# EAGLE design TLC5940_Breakout-v13 (EAGLE 6.4)
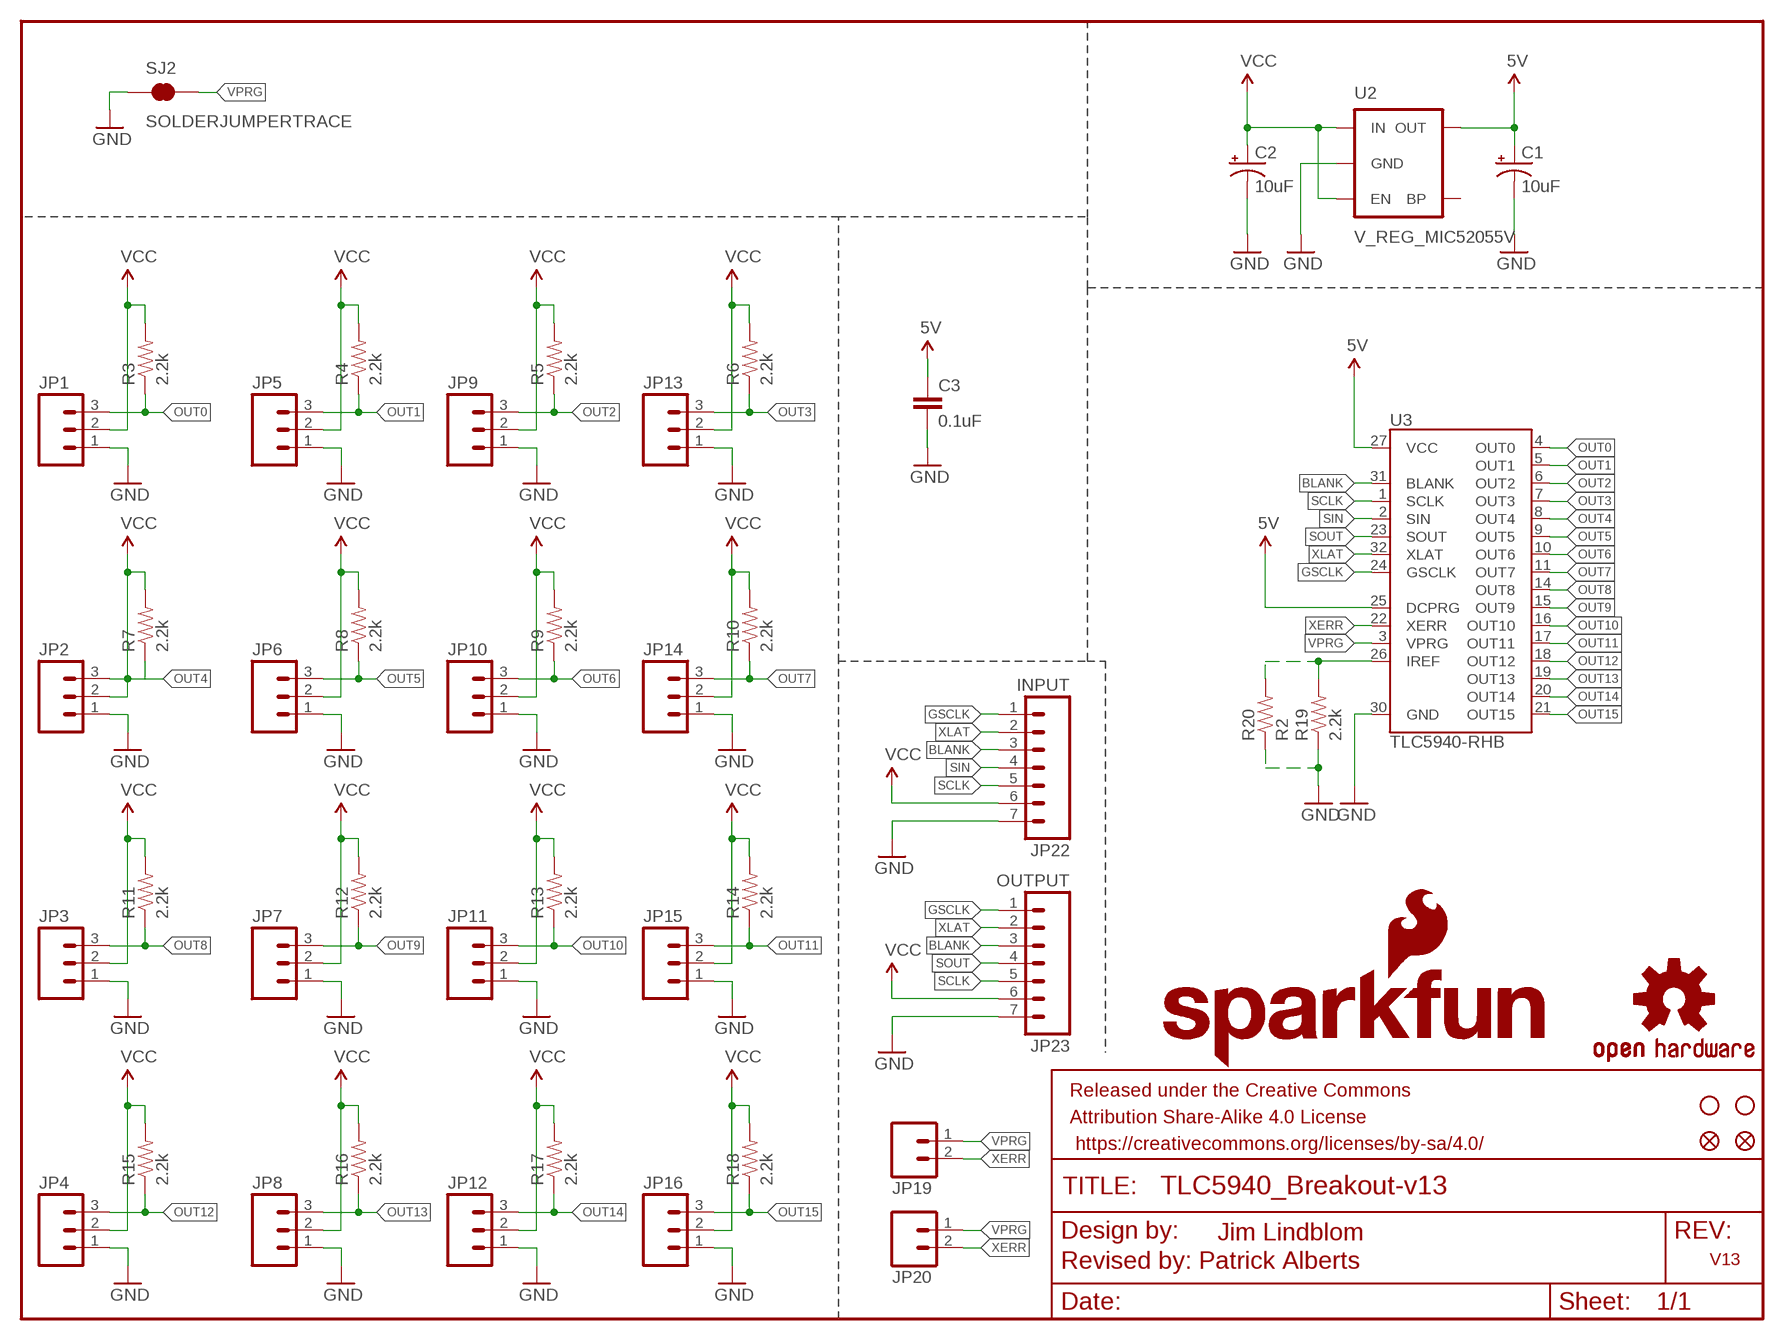
[diagram p0: schematic, sheet 1]

## Parts
C1  10uF  10UF-16V-10%(TANT)  [EIA3216]
C2  10uF  10UF-20V-10%(TANT)  [EIA3528]
C3  0.1uF  0.1UF-25V(+80/-20%)(0603)  [0603-CAP]
FRAME1  FRAME-LETTER  [CREATIVE_COMMONS]
JP1  M03PTH  [1X03]
JP2  M03PTH  [1X03]
JP3  M03PTH  [1X03]
JP4  M03PTH  [1X03]
JP5  M03PTH  [1X03]
JP6  M03PTH  [1X03]
JP7  M03PTH  [1X03]
JP8  M03PTH  [1X03]
JP9  M03PTH  [1X03]
JP10  M03PTH  [1X03]
JP11  M03PTH  [1X03]
JP12  M03PTH  [1X03]
JP13  M03PTH  [1X03]
JP14  M03PTH  [1X03]
JP15  M03PTH  [1X03]
JP16  M03PTH  [1X03]
JP17  STAND-OFF  [STAND-OFF]
JP18  STAND-OFF  [STAND-OFF]
JP19  M02PTH  [1X02]
JP20  M02PTH  [1X02]
JP22  INPUT  M07  [1X07]
JP23  OUTPUT  M07  [1X07]
JP26  FIDUCIAL1X2  [FIDUCIAL-1X2]
JP27  FIDUCIAL1X2.5  [FIDUCIAL-1X2.5]
LOGO1  OSHW-LOGOS  [OSHW-LOGO-S]
LOGO2  SFE_LOGO_NAME_FLAME.2_INCH  [SFE_LOGO_NAME_FLAME_.2]
R3  2.2k  2.2KOHM-1/10W-1%(0603)  [0603-RES]
R4  2.2k  2.2KOHM-1/10W-1%(0603)  [0603-RES]
R5  2.2k  2.2KOHM-1/10W-1%(0603)  [0603-RES]
R6  2.2k  2.2KOHM-1/10W-1%(0603)  [0603-RES]
R7  2.2k  2.2KOHM-1/10W-1%(0603)  [0603-RES]
R8  2.2k  2.2KOHM-1/10W-1%(0603)  [0603-RES]
R9  2.2k  2.2KOHM-1/10W-1%(0603)  [0603-RES]
R10  2.2k  2.2KOHM-1/10W-1%(0603)  [0603-RES]
R11  2.2k  2.2KOHM-1/10W-1%(0603)  [0603-RES]
R12  2.2k  2.2KOHM-1/10W-1%(0603)  [0603-RES]
R13  2.2k  2.2KOHM-1/10W-1%(0603)  [0603-RES]
R14  2.2k  2.2KOHM-1/10W-1%(0603)  [0603-RES]
R15  2.2k  2.2KOHM-1/10W-1%(0603)  [0603-RES]
R16  2.2k  2.2KOHM-1/10W-1%(0603)  [0603-RES]
R17  2.2k  2.2KOHM-1/10W-1%(0603)  [0603-RES]
R18  2.2k  2.2KOHM-1/10W-1%(0603)  [0603-RES]
R19  2.2k  2.2KOHM-1/10W-1%(0603)  [0603-RES]
R20  R2  RESISTORKIT  [AXIAL-0.3-KIT]
SJ2  SOLDERJUMPERTRACE  [SJ_2S-TRACE]
U2  V_REG_MIC52055V  [SOT23-5]
U3  TLC5940-RHB  [QFN-32]

## Nets
5V: C1.A(+) C3.1 U2.5(OUT) U3.25(DCPRG) U3.27(VCC)
BLANK: JP22.3 JP23.3 U3.31(BLANK)
GND: C1.C(-) C2.C(-) C3.2 JP1.1 JP2.1 JP3.1 JP4.1 JP5.1 JP6.1 JP7.1 JP8.1 JP9.1 JP10.1 JP11.1 JP12.1 JP13.1 JP14.1 JP15.1 JP16.1 JP22.7 JP23.7 R19.1 R20.P$1 SJ2.1 U2.2(GND) U3.30(GND)
GSCLK: JP22.1 JP23.1 U3.24(GSCLK)
N$1: R19.2 R20.P$2 U3.26(IREF)
OUT0: JP1.3 R3.1 U3.4(OUT0)
OUT1: JP5.3 R4.1 U3.5(OUT1)
OUT2: JP9.3 R5.1 U3.6(OUT2)
OUT3: JP13.3 R6.1 U3.7(OUT3)
OUT4: JP2.3 R7.1 U3.8(OUT4)
OUT5: JP6.3 R8.1 U3.9(OUT5)
OUT6: JP10.3 R9.1 U3.10(OUT6)
OUT7: JP14.3 R10.1 U3.11(OUT7)
OUT8: JP3.3 R11.1 U3.14(OUT8)
OUT9: JP7.3 R12.1 U3.15(OUT9)
OUT10: JP11.3 R13.1 U3.16(OUT10)
OUT11: JP15.3 R14.1 U3.17(OUT11)
OUT12: JP4.3 R15.1 U3.18(OUT12)
OUT13: JP8.3 R16.1 U3.19(OUT13)
OUT14: JP12.3 R17.1 U3.20(OUT14)
OUT15: JP16.3 R18.1 U3.21(OUT15)
SCLK: JP22.5 JP23.5 U3.1(SCLK)
SIN: JP22.4 U3.2(SIN)
SOUT: JP23.4 U3.23(SOUT)
VCC: C2.A(+) JP1.2 JP2.2 JP3.2 JP4.2 JP5.2 JP6.2 JP7.2 JP8.2 JP9.2 JP10.2 JP11.2 JP12.2 JP13.2 JP14.2 JP15.2 JP16.2 JP22.6 JP23.6 R3.2 R4.2 R5.2 R6.2 R7.2 R8.2 R9.2 R10.2 R11.2 R12.2 R13.2 R14.2 R15.2 R16.2 R17.2 R18.2 U2.1(IN) U2.3(EN)
VPRG: JP19.1 JP20.1 SJ2.2 U3.3(VPRG)
XERR: JP19.2 JP20.2 U3.22(XERR)
XLAT: JP22.2 JP23.2 U3.32(XLAT)
Unconnected: U2.4(BP)

## Notes on the sheet
- Jim Lindblom
- Revised by: Patrick Alberts | V13

## Library data of the parts
C1 = SparkFun-Capacitors:10UF-16V-10%(TANT): CAP-00811 1206/EIA-3216 Tantalum capacitor; PROD_ID: CAP-00811
C2 = SparkFun-Capacitors:10UF-20V-10%(TANT): CAP-08063; PROD_ID: CAP-08063
C3 = SparkFun-Capacitors:0.1UF-25V(+80/-20%)(0603): CAP-00810 Ceramic Standard decoupling cap; PROD_ID: CAP-00810
FRAME1 = SparkFun-Aesthetics:FRAME-LETTER: Schematic Frame Standard 8.5x11 US Letter frame
JP1-JP16 = SparkFun:M03: Header 3 Standard 3-pin 0.1" header. Use with straight break away headers (SKU : PRT-00116), right angle break away headers (PRT-00553), swiss pins (PRT-00743), machine pins (PRT-00117), and female headers (PRT-00115). Molex polarized connector foot print use with SKU : PRT-08232 with associated crimp pins and housings.
JP17 JP18 = SparkFun:STAND-OFF: Stand Off This is the mechanical footprint for a #4 phillips button head screw. Use the keepout ring to avoid running the screw head into surrounding components. SKU : PRT-00447
JP19 JP20 = SparkFun:M02: Header 2 Standard 2-pin 0.1" header. Use with straight break away headers (SKU : PRT-00116), right angle break away headers (PRT-00553), swiss pins (PRT-00743), machine pins (PRT-00117), and female headers (PRT-00115). Molex polarized connector foot print use with SKU : PRT-08233 with associated crimp pins and housings.
JP22 JP23 = SparkFun:M07: Header 7 Standard 7-pin 0.1" header. Use with straight break away headers (SKU : PRT-00116), right angle break away headers (PRT-00553), swiss pins (PRT-00743), machine pins (PRT-00117), and female headers (PRT-00115). NOTES ON THE VARIANTS LOCK and LOCK_LONGPADS... This footprint was designed to help hold the alignment of a through-hole component (i.e. 7-pin header) while soldering it into place. You may notice that each hole has been shifted either up or down by 0.005 of an inch from it's more standard position (which is usually a perfectly straight line). This slight alteration caused the pins (the squares in the middle) to touch the edges of the holes. Because they are alternating, it causes a "brace" to hold the header in place. 0.005 has proven to be the perfect amount of "off-center" position when using our standard breakaway headers. Although looks a little odd when you look at the bare footprint, once you have a header in there, the alteration is very hard to notice. Also, if you push a header all the way into place, it is covered up entirely on the bottom side. This idea of altering the position of holes to aid alignment will be further integrated into the Sparkfun Library for other footprints. It can help hold any component with 3 or more connection pins.
JP26 = SparkFun:FIDUCIAL: Fiducial Alignment Points Various fiducial points for machine vision alignment.
JP27 = abes:FIDUCIAL: Fiducial Alignment Points Various fiducial points for machine vision alignment.
LOGO1 = SparkFun-Aesthetics:OSHW-LOGO: Open Source Hardware Logo This logo indicates the piece of hardware it is found on incorporates a OSHW license and/or adheres to the definition of open source hardware found here: http://freedomdefined.org/OSHW
LOGO2 = SparkFun-Aesthetics:SFE_LOGO_NAME_FLAME: SFE Logo, name and flame This is the SparkFun full logo. The logo on the schematic will always be the same size; the package variant is the height of the flame part of the logo. Default layer for the logo on the board is tSilk.
R3-R19 = SparkFun-Resistors:2.2KOHM-1/10W-1%(0603): RES-08272; PROD_ID: RES-08272
R20 = SparkFun-Resistors:RESISTOR: Resistor Basic schematic elements and footprints for 0603, 1206, and PTH resistors.
SJ2 = SparkFun:SOLDERJUMPER: Solder Jumper Standard SMD solder jumper. Used to automate production. Two varients : Normally Open and Normally Closed are the same, but have different paste layers. NC will have a large amount of paste and should jumper during reflow.
U2 = SparkFun-PowerIC:V_REG_MIC5205: V_REG MIC5219 Standard 3.3V and 5V 150mA LDO voltage regulator in SOT-23 layout. Micrel part MIC5205. BP (by-pass) pin is used to lower output noise with 470pF cap, may be left open.; PROD_ID: VREG-00823; VALUE: 5V
U3 = SparkFun-DigitalIC:TLC5940: 16-channel LED Driver with Dot Correction and Grayscale PWM Control The TLC5940 is a 16-channel, constant-current sink LED driver. Each channel has an individually adjustable 4096-step grayscale PWM brightness control and a 64-step, constant-current sink (dot correction). The dot correction adjusts the brightness variations between LED channels and other LED drivers. The dot correction data is stored in an integrated EEPROM. Both grayscale control and dot correction are accessible via a serial interface. A single external resistor sets the maximum current value of all 16 channels. Packages: 28-pin HTSSOP 32-pin 5x5mm QFN 28-pin DIP; PROD_ID: IC-10398

## Board
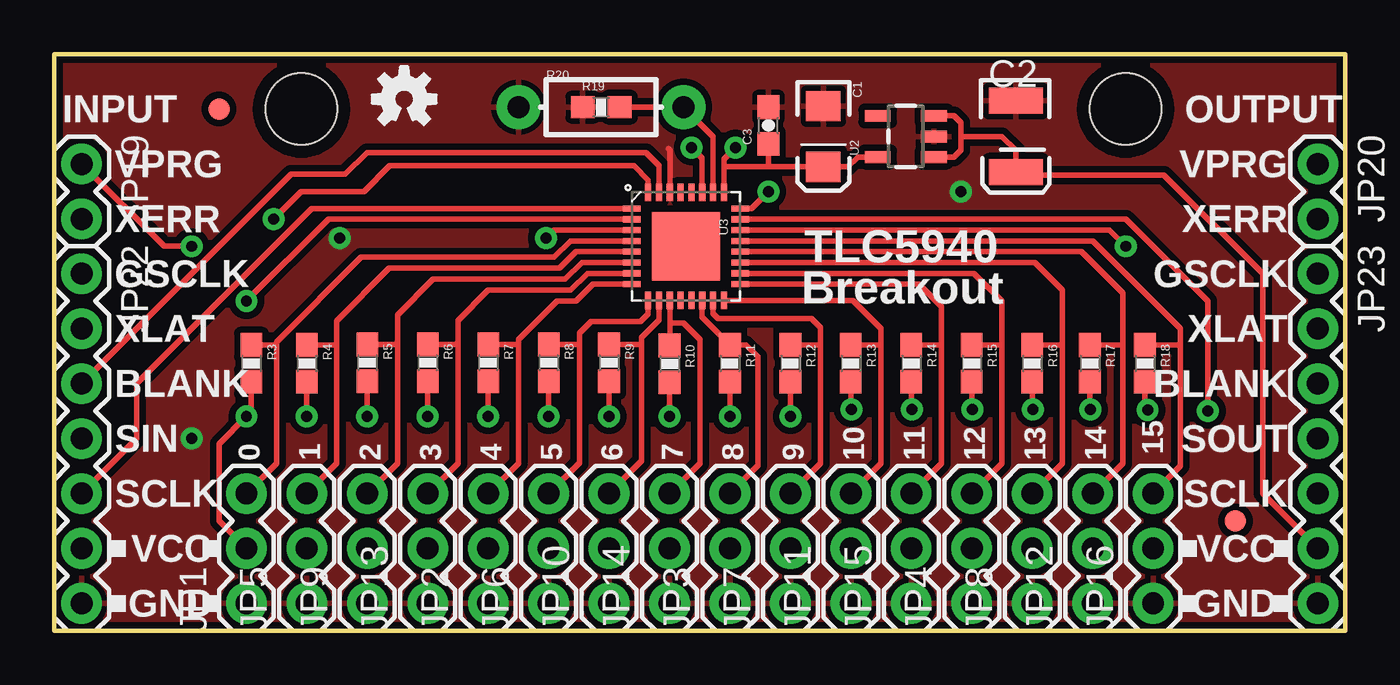
[diagram p1: board, top side]
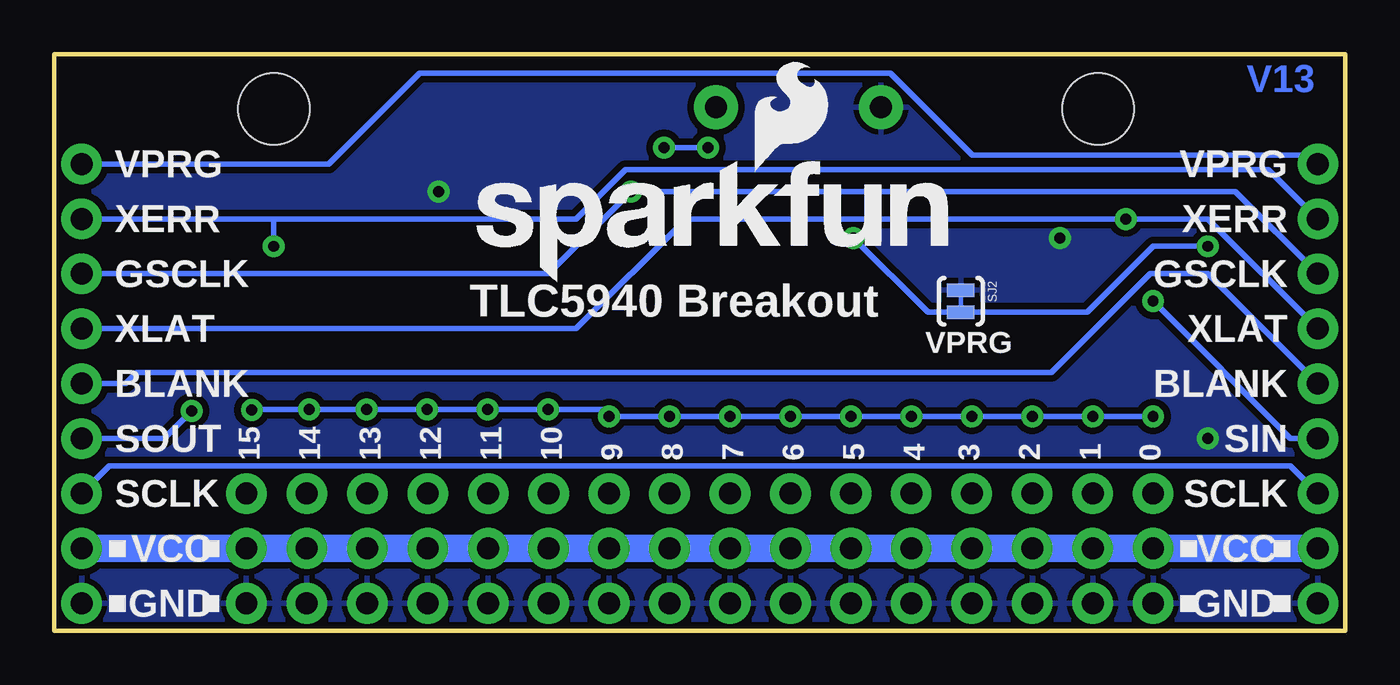
[diagram p2: board, bottom side, seen from below]

Size 59.69 x 26.67 mm. Coordinates in mm from the lower left corner, seen from the top.
Outline: 0,0 0,26.67 59.69,26.67 59.69,0 0,0
Copper layers (1*16): Top 0.035mm / dielectric 1.5mm / Bottom 0.035mm
Design rules "SparkFun *": minimum track width 8mil, minimum drill 20mil, track to track 8mil, track to pad 8mil, pad to pad 8mil, via to via 8mil, smd to smd 8mil, copper to edge 8mil, drill to drill 8mil, minimum pad ring 12mil, minimum via ring 10mil, stop-mask expansion 4mil, vias tented up to drill 20mil, thermal gap 10mil

### Footprints (pad centres in the part's own frame; a part is rotated, then mirrored left to right if it is on the bottom)
EIA3216 = smd 1.4 x 1.6: A 1.4,0; C -1.4,0
EIA3528 = smd 1.2 x 2.5: A 1.65,0; C -1.65,0
0603-CAP = smd 1.1 x 1: 1 -0.85,0; 2 0.85,0
1X03 = drill 1.016 pad 1.88: 1 0,0; 2 2.54,0; 3 5.08,0
STAND-OFF = hole 3.302: 0,0
1X02 = drill 1.016 pad 1.88: 1 0,0; 2 2.54,0
FIDUCIAL-1X2 = smd 1 x 1: 1 0,0
1X07 = drill 1.016 pad 1.88: 1 0,0; 2 2.54,0; 3 5.08,0; 4 7.62,0; 5 10.16,0; 6 12.7,0; 7 15.24,0
0603-RES = smd 1.1 x 1: 1 -0.85,0; 2 0.85,0
AXIAL-0.3-KIT = drill 1.016 pad 2.032: P$1 -3.81,0; P$2 3.81,0
SJ_2S-TRACE = smd 0.635 x 1.27: 1 -0.508,0; 2 0.508,0
SOT23-5 = smd 0.55 x 1.2: 1 -0.95,-1.3; 2 0,-1.3; 3 0.95,-1.3; 4 0.95,1.3; 5 -0.95,1.3
QFN-32 = smd 0.285 x 0.8: 1 -1.75,-2.5; 2 -1.25,-2.5; 3 -0.75,-2.5; 4 -0.25,-2.5; 5 0.25,-2.5; 6 0.75,-2.5; 7 1.25,-2.5; 8 1.75,-2.5; 17 1.75,2.5; 18 1.25,2.5; 19 0.75,2.5; 20 0.25,2.5; 21 -0.25,2.5; 22 -0.75,2.5; 23 -1.25,2.5; 24 -1.75,2.5 | smd 0.8 x 0.285: 9 2.5,-1.75; 10 2.5,-1.25; 11 2.5,-0.75; 12 2.5,-0.25; 13 2.5,0.25; 14 2.5,0.75; 15 2.5,1.25; 16 2.5,1.75; 25 -2.5,1.75; 26 -2.5,1.25; 27 -2.5,0.75; 28 -2.5,0.25; 29 -2.5,-0.25; 30 -2.5,-0.75; 31 -2.5,-1.25; 32 -2.5,-1.75 | smd 3.15 x 3.15: EP 0,0

### Placement (x,y rotation side)
C1  35.56,22.86 270 top
C2  44.45,22.86 270 top
C3  33.02,23.37 90 top
FRAME1  -2.54,-16.51 0 top  (outside the outline)
JP1  8.89,1.27 90 top
JP2  20.07,1.27 90 top
JP3  31.24,1.27 90 top
JP4  42.42,1.27 90 top
JP5  11.68,1.27 90 top
JP6  22.86,1.27 90 top
JP7  34.04,1.27 90 top
JP8  45.21,1.27 90 top
JP9  14.48,1.27 90 top
JP10  25.65,1.27 90 top
JP11  36.83,1.27 90 top
JP12  48.01,1.27 90 top
JP13  17.27,1.27 90 top
JP14  28.45,1.27 90 top
JP15  39.62,1.27 90 top
JP16  50.8,1.27 90 top
JP17  11.43,24.13 0 top
JP18  49.53,24.13 0 top
JP19  1.27,21.59 270 top
JP20  58.42,21.59 270 top
JP21  FIDUCIAL1X2  [FIDUCIAL-1X2]  54.61,5.08 0 top
JP22  1.27,16.51 270 top
JP23  58.42,16.51 270 top
JP26  7.62,24.13 0 top
LOGO1  16.18,24.59 0 top
LOGO2  40.87,16.03 0 bottom
R3  9.12,12.37 270 top
R4  11.68,12.37 270 top
R5  14.48,12.4 270 top
R6  17.27,12.4 270 top
R7  20.07,12.4 270 top
R8  22.86,12.4 270 top
R9  25.65,12.4 270 top
R10  28.45,12.34 270 top
R11  31.24,12.37 270 top
R12  34.04,12.37 270 top
R13  36.83,12.37 270 top
R14  39.62,12.37 270 top
R15  42.42,12.37 270 top
R16  45.21,12.37 270 top
R17  47.88,12.37 270 top
R18  50.42,12.37 270 top
R19  25.29,24.21 0 top
R20  25.29,24.21 0 top
SJ2  17.78,15.24 270 bottom
U2  39.37,22.86 90 top
U3  29.21,17.78 270 top

### Tracks (layer width: path | path; a pad name or v marks a point on that pad's centre or on a via)
5V  (via drill 0.51)
  Top 0.254: U2.5 37.15,21.91 36.7,21.46 C1.A 33.02,21.46 | U3.27 29.96,21.86 v29.46,22.35 | 30.96,21.46 30.96,21.82 v31.5,22.35 | 30.96,21.46 U3.25 | 33.02,21.46 30.96,21.46 | 33.02,21.46 C3.1
  Bottom 0.254: v29.46,22.35 v31.5,22.35
BLANK
  Top 0.254: JP22.3 10.95,21.11 13.46,21.11 14.48,22.12 27.36,22.12 27.96,21.52 U3.31
  Bottom 0.254: JP23.3 56.39,11.43 55.88,11.94 13.59,11.94 9.02,16.51 6.35,16.51 JP22.3
GND  (via drill 0.51)
  Top 0.254: U3.30 28.46,22.24 28.4,22.3
  other vias: 13.21,18.16 6.35,8.89 41.91,20.32
  pour Bottom (isolate 0.305): 0,26.67 0,0 59.69,0 59.69,26.67
  pour Top (isolate 0.305): 0,26.67 0,0 59.69,0 59.69,26.67
GSCLK  (via drill 0.51)
  Top 0.254: U3.24 32.23,19.53 v33.02,20.32
  Bottom 0.254: JP22.1 5.08,20.32 v33.02,20.32 36.83,16.51 JP23.1
N$1
  Top 0.254: R19.2 R20.P$2 30.46,22.85 U3.26
OUT0
  Top 0.254: JP1.3 10.29,7.75 10.29,12.7 10.29,13.22 | 10.29,13.22 10.29,13.37 14.19,17.27 23.11,17.27 23.87,18.03 U3.4 | R3.1 10.29,13.22
OUT1
  Top 0.254: U3.5 24.13,17.53 23.37,16.76 15.49,16.76 13.07,14.34 13.07,13.22 | 13.07,13.22 13.07,7.73 JP5.3 | R4.1 13.07,13.22
OUT2
  Top 0.254: JP9.3 15.88,7.75 15.88,13.24 | 15.88,13.24 15.88,13.34 | 15.88,13.34 15.86,13.35 | U3.6 24.4,17.03 23.62,16.26 17.53,16.26 15.88,14.61 15.88,13.34 | R5.1 15.88,13.24
OUT3
  Top 0.254: JP13.3 18.67,7.75 18.67,13.24 | 18.67,13.24 18.67,13.34 | 18.67,13.34 18.67,14.35 20.07,15.75 23.88,15.75 24.66,16.53 U3.7 | 18.67,13.34 18.65,13.35 | R6.1 18.67,13.24
OUT4
  Top 0.254: JP2.3 21.46,7.75 21.46,13.24 | 21.46,13.24 21.46,13.46 23.24,15.24 24.13,15.24 24.92,16.03 U3.8 | R7.1 21.46,13.24
OUT5
  Top 0.254: U3.9 27.46,14.66 27.1,14.3 24.82,14.3 24.28,13.77 24.28,13.24 | R8.1 24.28,13.24 | 24.28,13.24 24.28,7.77 JP6.3
OUT6
  Top 0.254: U3.10 27.96,14.37 27.15,13.56 27.15,13.24 | 27.15,13.24 27.15,7.85 JP10.3 | R9.1 27.15,13.24
OUT7
  Top 0.254: JP14.3 29.84,7.75 29.84,13.46 29.08,14.22 28.46,14.22 | 28.46,14.22 U3.11 | R10.1 28.46,14.22
OUT8
  Top 0.254: U3.14 29.96,14.5 R11.1 31.99,13.22 32.54,12.68 32.54,7.64 JP3.3
OUT9
  Top 0.254: JP7.3 35.43,7.75 35.43,13.22 | R12.1 35.43,13.22 | U3.15 30.46,14.68 30.68,14.45 35,14.45 35.43,14.02 35.43,13.22
OUT10
  Top 0.254: JP11.3 38.23,7.75 38.23,13.22 | U3.16 36.92,15.28 38.23,13.97 38.23,13.22 | R13.1 38.23,13.22
OUT11
  Top 0.254: JP15.3 41.02,7.75 41.02,13.22 | U3.17 39.98,16.03 41.02,14.99 41.02,13.22 | R14.1 41.02,13.22
OUT12
  Top 0.254: JP4.3 43.81,7.75 43.81,13.22 | U3.18 42.52,16.53 43.81,15.24 43.81,13.22 | R15.1 43.81,13.22
OUT13
  Top 0.254: JP8.3 46.61,7.75 46.61,13.22 | U3.19 45.33,17.03 46.61,15.75 46.61,13.22 | R16.1 46.61,13.22
OUT14
  Top 0.254: JP12.3 49.4,7.75 49.4,13.22 | 49.4,13.22 49.4,15.62 47.49,17.53 U3.20 | R17.1 49.4,13.22
OUT15
  Top 0.254: JP16.3 52.07,7.62 52.07,13.22 | 52.07,13.22 52.07,13.97 48.01,18.03 U3.21 | R18.1 52.07,13.22
SCLK
  Top 0.254: U3.1 11.91,19.53 3.81,11.43 3.81,8.89 JP22.5
  Bottom 0.254: JP23.5 57.15,7.62 2.54,7.62 JP22.5
SIN  (via drill 0.51)
  Top 0.254: U3.2 12.68,19.03 v8.89,15.24
  Bottom 0.254: v8.89,15.24 2.54,8.89 JP22.4
SOUT  (via drill 0.51)
  Top 0.254: U3.23 49.55,19.03 53.34,15.24 v53.34,10.16
  Bottom 0.254: v53.34,10.16 54.61,8.89 JP23.4
VCC  (via drill 0.51)
  Top 0.254: v11.68,9.91 R4.2 | v14.48,9.91 R5.2 | v17.27,9.91 R6.2 | v20.07,9.91 R7.2 | v22.86,9.91 R8.2 | v25.65,9.91 R9.2 | v28.45,9.91 R10.2 | v31.24,9.91 R11.2 | v34.04,9.91 R12.2 | U2.3 41.59,23.81 41.91,23.5 41.91,22.86 | U2.1 41.59,21.91 41.91,22.23 41.91,22.86 | 41.91,22.86 43.81,22.86 44.45,22.23 C2.A 44.58,21.21 44.7,21.08 51.31,21.08 55.88,16.51 55.88,6.35 JP23.6 | JP1.2 7.62,5.08 7.62,8.64 v8.89,9.91 9.12,10.13 R3.2 | R13.2 36.83,10.26 v36.85,10.24 | R14.2 39.62,10.26 v39.65,10.24 | R15.2 42.42,10.26 v42.44,10.24 | R16.2 45.21,10.26 v45.24,10.24 | R17.2 47.88,10.26 v47.9,10.24 | R18.2 50.42,10.34 v50.55,10.21
  Bottom 0.254: v8.89,9.91 v11.68,9.91 v14.48,9.91 v17.27,9.91 v20.07,9.91 v22.86,9.91 v25.65,9.91 v28.45,9.91 v31.24,9.91 v34.04,9.91 34.37,10.24 v36.85,10.24 v39.65,10.24 v42.44,10.24 v45.24,10.24 v47.9,10.24 50.52,10.24 v50.55,10.21
  Bottom 1.27: JP22.6 JP1.2 JP5.2 JP9.2 JP13.2 JP2.2 JP6.2 JP10.2 JP14.2 JP3.2 JP7.2 JP11.2 JP15.2 JP4.2 JP8.2 JP12.2 JP16.2 JP23.6
VPRG  (via drill 0.51)
  Top 0.254: U3.3 23.1,18.53 v22.73,18.16 | v6.35,17.78 5.08,17.78 JP19.1
  Bottom 0.254: v22.73,18.16 19.3,14.73 SJ2.2 11.94,14.73 8.89,17.78 v6.35,17.78 | JP20.1 46.99,21.59 42.8,25.78 21.03,25.78 17.25,22 1.68,22 JP19.1 1.65,21.97
XERR  (via drill 0.51)
  Top 0.254: U3.22 48.78,18.53 v49.53,17.78
  Bottom 0.254: 49.53,19.05 35.56,19.05 33.27,21.34 3.56,21.34 JP19.2 | 49.53,19.05 JP20.2 | 49.53,19.05 v49.53,17.78
XLAT  (via drill 0.51)
  Top 0.254: U3.32 27.46,20.85 26.8,21.51 15.52,21.51 14.33,20.32 11.43,20.32 v10.16,19.05
  Bottom 0.254: JP22.2 6.35,19.05 v10.16,19.05 30.48,19.05 35.56,13.97 JP23.2

### Text on the board
Bottom: V13
tPlace: OUTPUT | INPUT | VPRG | VPRG | XERR | XERR | TLC5940 | GSCLK | GSCLK | Breakout | XLAT | XLAT | BLANK | BLANK | 15 | SOUT | SIN | 0 | 1 | 2 | 3 | 4 | 5 | 6 | 7 | 8 | 9 | 10 | 11 | 12 | 13 | 14 | SCLK | SCLK | VCC | VCC | GND | GND
bPlace: VPRG | VPRG | XERR | XERR | GSCLK | GSCLK | XLAT | TLC5940 Breakout | VPRG | XLAT | BLANK | BLANK | SIN | 0 | 1 | 2 | 3 | 4 | 5 | 6 | 7 | 8 | 9 | 10 | 11 | 12 | 13 | 14 | 15 | SOUT | SCLK | SCLK | VCC | VCC | GND | GND
tDocu: Jim Lindblom | Revised by: Patrick Alberts